# Altium schematic sheet PoE.schdoc
size 518 x 329 mm
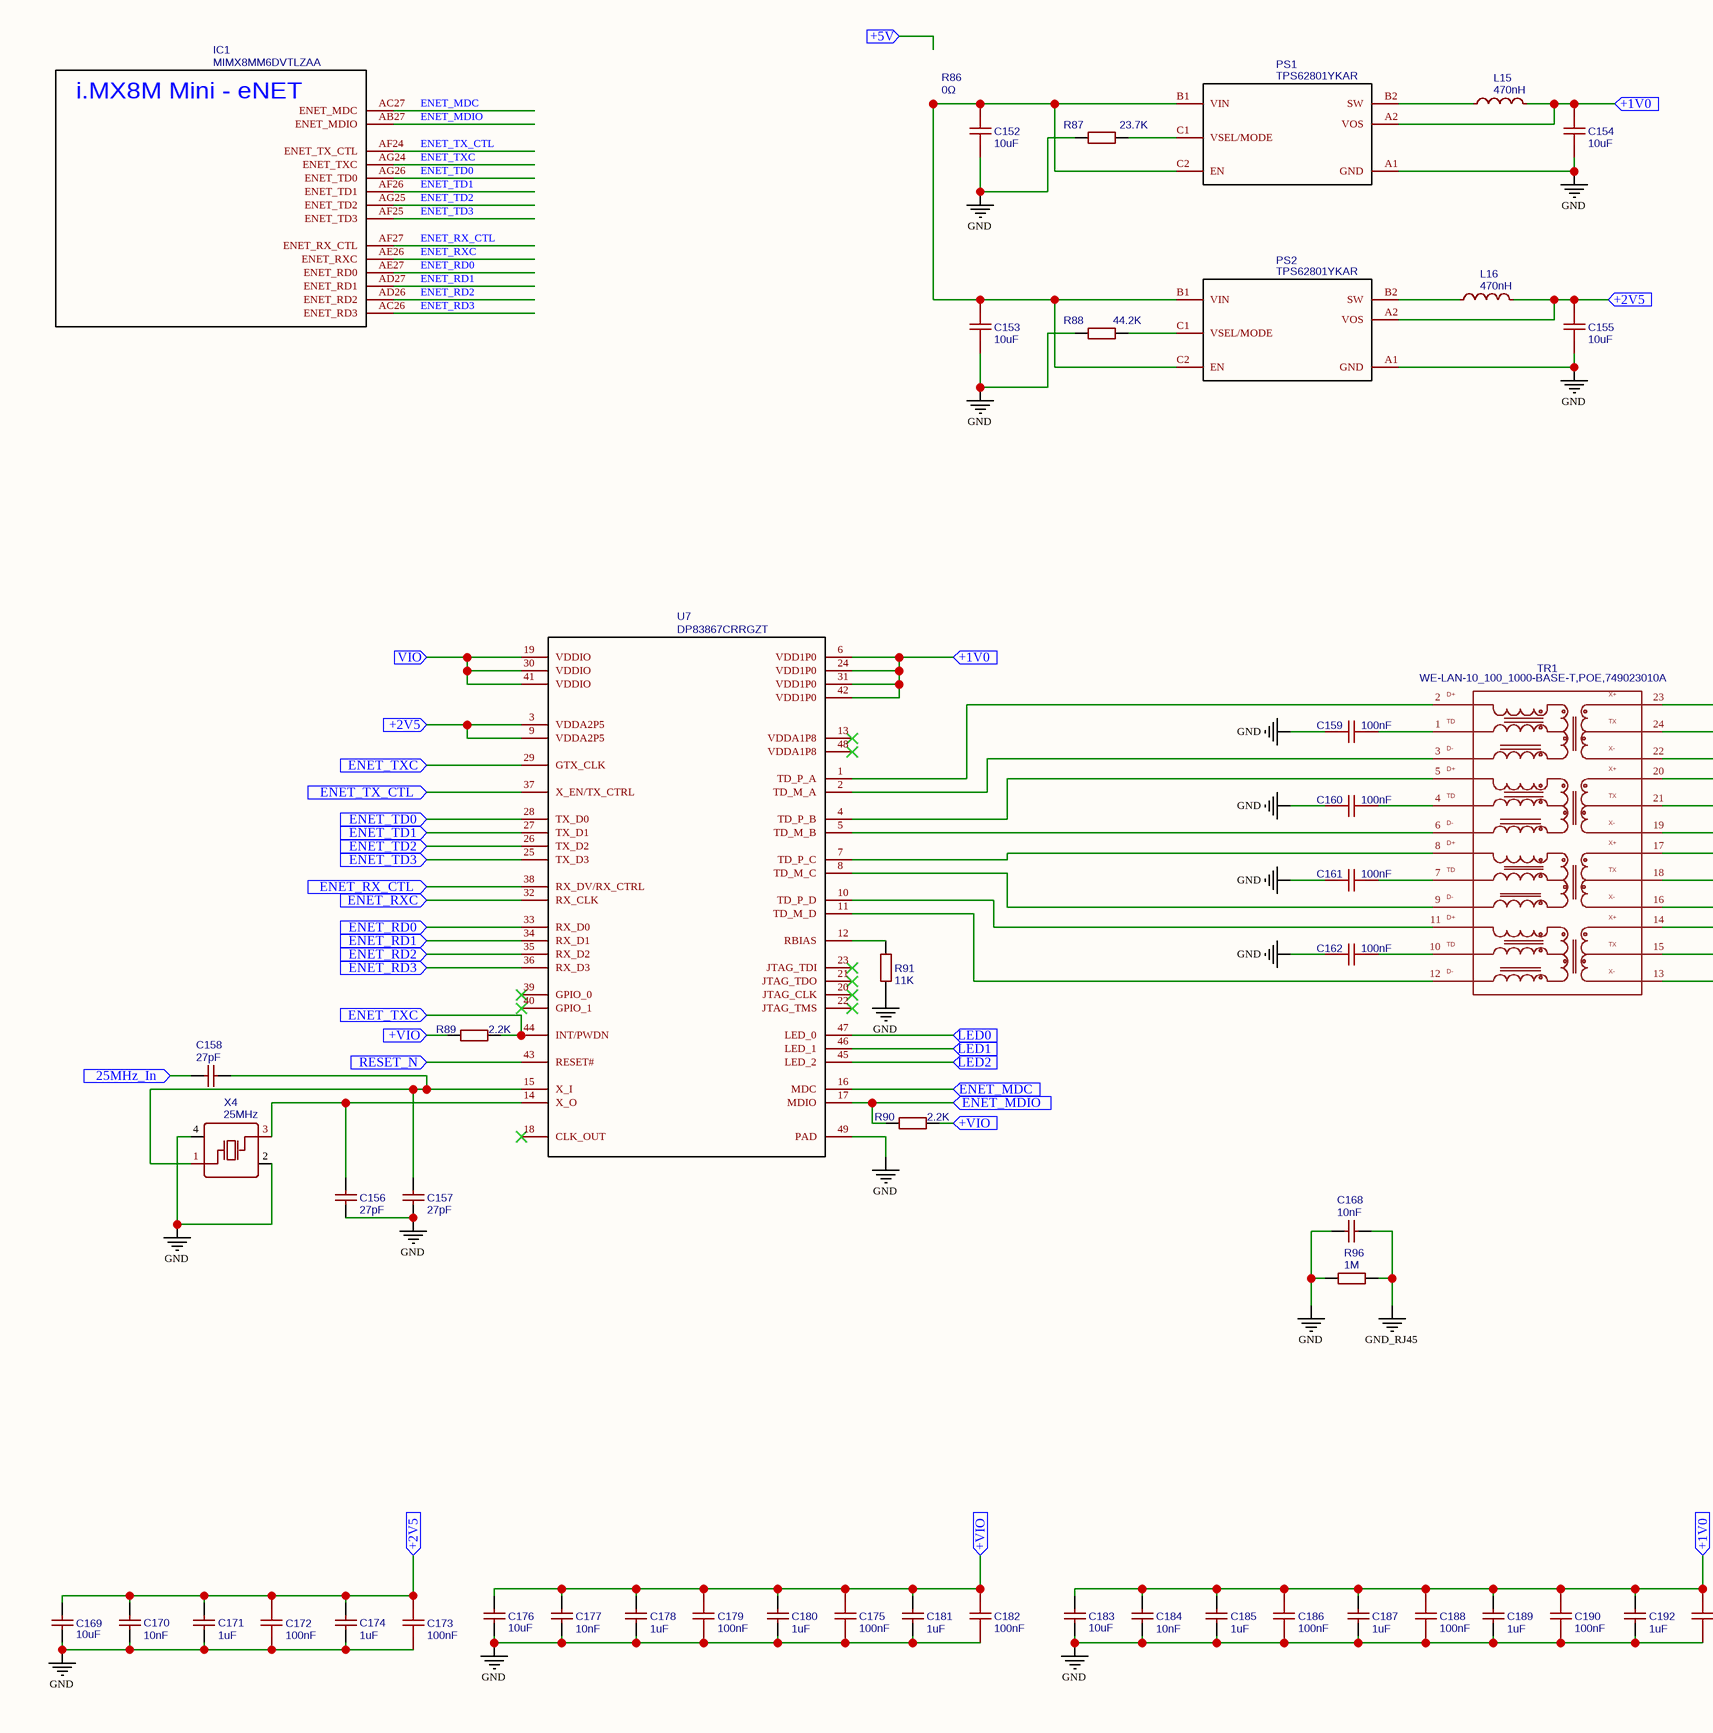
[diagram p0: PoE.schdoc, left]
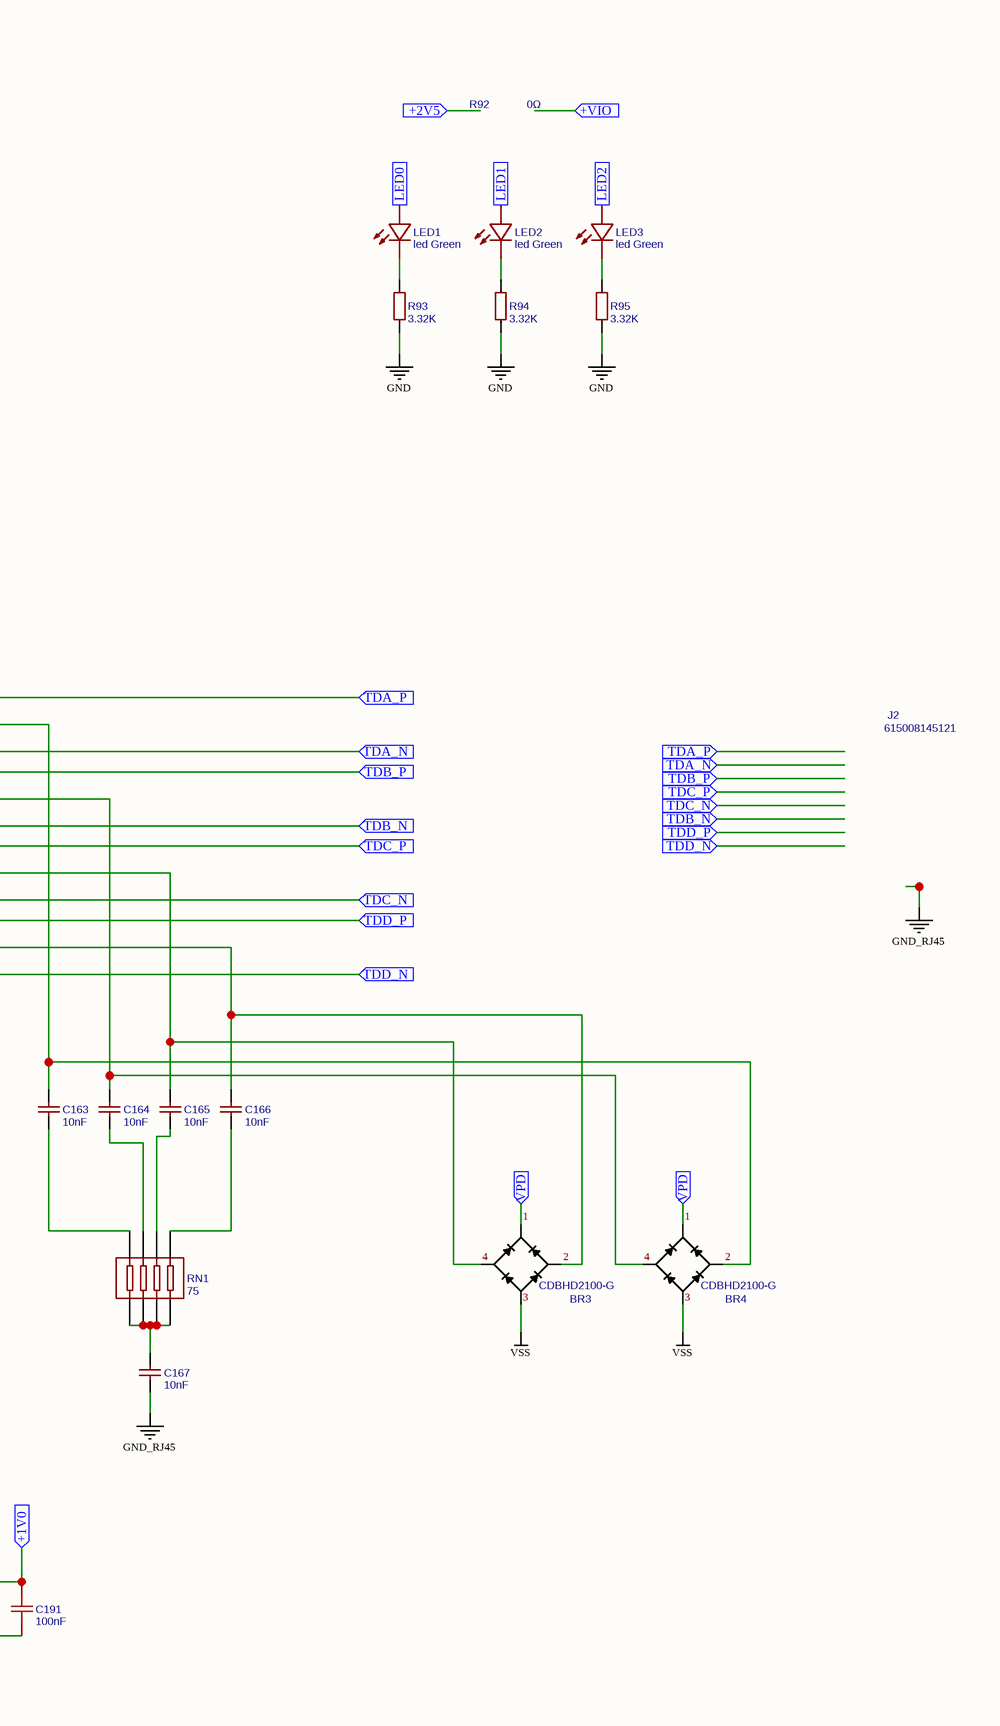
[diagram p1: PoE.schdoc, right]

## Parts
BR3  CDBHD2100-G  [SOP250P700X290-4N]
BR4  CDBHD2100-G  [SOP250P700X290-4N]
C152  10uF  [C1206]
C153  10uF  [C1206]
C154  10uF  [C1206]
C155  10uF  [C1206]
C156  27pF  [C0402]
C157  27pF  [C0402]
C158  27pF  [C0402]
C159  100nF  [C0603]
C160  100nF  [C0603]
C161  100nF  [C0603]
C162  100nF  [C0603]
C163  10nF  [C0805]
C164  10nF  [C0805]
C165  10nF  [C0805]
C166  10nF  [C0805]
C167  10nF  [C1206]
C168  10nF  [C1206]
C169  10uF  [C0402]
C170  10nF  [C0402]
C171  1uF  [C0603]
C172  100nF  [C0603]
C173  100nF  [C0603]
C174  1uF  [C0603]
C175  100nF  [C0603]
C176  10uF  [C0402]
C177  10nF  [C0402]
C178  1uF  [C0603]
C179  100nF  [C0603]
C180  1uF  [C0603]
C181  1uF  [C0603]
C182  100nF  [C0603]
C183  10uF  [C0402]
C184  10nF  [C0402]
C185  1uF  [C0603]
C186  100nF  [C0603]
C187  1uF  [C0603]
C188  100nF  [C0603]
C189  1uF  [C0603]
C190  100nF  [C0603]
C191  100nF  [C0603]
C192  1uF  [C0603]
IC1  MIMX8MM6DVTLZAA  [BGA486C50P27X27_1400X1400X125]
J2  615008145121  [615008145121]
L15  470nH  [L0603]
L16  470nH  [L0603]
LED1  led Green  [LED1206-RD]
LED2  led Green  [LED1206-RD]
LED3  led Green  [LED1206-RD]
PS1  TPS62801YKAR  [BGA6C35P2X3_70X105X40]
PS2  TPS62801YKAR  [BGA6C35P2X3_70X105X40]
R86  0Ω  [1206]
R87  23.7K  [R0402]
R88  44.2K  [R0402]
R89  2.2K  [R0402]
R90  2.2K  [R0402]
R91  11K  [R0402]
R92  0Ω  [1206]
R93  3.32K  [R0402]
R94  3.32K  [R0402]
R95  3.32K  [R0402]
R96  1M  [R0402]
RN1  75  [RES-ARRAY-SMD_0402-8P-L2.0-W1.0-BL]
TR1  WE-LAN-10_100_1000-BASE-T,POE,749023010A  [749023010A]
U7  DP83867CRRGZT  [QFN50P700X700X100-49N]
X4  25MHz  [OSC-SMD_4P-L3.2-W2.5-BL]

## Ports
25MHz_In (in), +1V0 (in), +2V5 (in), +5V (in), +VIO (in), ENET_MDC (in), ENET_MDIO (in), ENET_RD0 (in), ENET_RD1 (in), ENET_RD2 (in), ENET_RD3 (in), ENET_RX_CTL (in), ENET_RXC (in), ENET_TD0 (in), ENET_TD1 (in), ENET_TD2 (in), ENET_TD3 (in), ENET_TX_CTL (in), ENET_TXC (in), LED0 (in), LED1 (in), LED2 (in), RESET_N (in), TDA_N (in), TDA_P (in), TDB_N (in), TDB_P (in), TDC_N (in), TDC_P (in), TDD_N (in), TDD_P (in), VIO (in), VPD (in)

## Nets
GND: C152.1 C153.1 C154.1 C155.1 C156.1 C157.1 C159.1 C160.1 C161.1 C162.1 C168.2 C169.1 C170.1 C171.1 C172.1 C173.1 C174.1 C175.1 C176.1 C177.1 C178.1 C179.1 C180.1 C181.1 C182.1 C183.1 C184.1 C185.1 C186.1 C187.1 C188.1 C189.1 C190.1 C191.1 C192.1 PS1.A1(GND) PS2.A1(GND) R87.1 R88.1 R91.1 R93.1 R94.1 R95.1 R96.1 U7.49(PAD) X4.2(GND) X4.4(GND)
GND_RJ45: C167.1 C168.1 R96.2
VSS: BR3.3 BR4.3
25MHz_In: C158.2 ; port 25MHz_In
+1V0: C154.2 C183.2 C184.2 C185.2 C186.2 C187.2 C188.2 C189.2 C190.2 C191.2 C192.2 L15.2 PS1.A2(VOS) U7.6(VDD1P0) U7.24(VDD1P0) U7.31(VDD1P0) U7.42(VDD1P0) ; port +1V0
+2V5: C155.2 C169.2 C170.2 C171.2 C172.2 C173.2 C174.2 L16.2 PS2.A2(VOS) U7.3(VDDA2P5) U7.9(VDDA2P5) ; port +2V5
+VIO: C175.2 C176.2 C177.2 C178.2 C179.2 C180.2 C181.2 C182.2 R89.1 R90.2 ; port +VIO
ENET_MDC: IC1.AC27(ENET_MDC)
ENET_MDC: U7.16(MDC) ; port ENET_MDC  [a separate net that carries the same name]
ENET_MDIO: IC1.AB27(ENET_MDIO)
ENET_MDIO: R90.1 U7.17(MDIO) ; port ENET_MDIO  [a separate net that carries the same name]
ENET_RD0: IC1.AE27(ENET_RD0)
ENET_RD0: U7.33(RX_D0) ; port ENET_RD0  [a separate net that carries the same name]
ENET_RD1: IC1.AD27(ENET_RD1)
ENET_RD1: U7.34(RX_D1) ; port ENET_RD1  [a separate net that carries the same name]
ENET_RD2: IC1.AD26(ENET_RD2)
ENET_RD2: U7.35(RX_D2) ; port ENET_RD2  [a separate net that carries the same name]
ENET_RD3: IC1.AC26(ENET_RD3)
ENET_RD3: U7.36(RX_D3) ; port ENET_RD3  [a separate net that carries the same name]
ENET_RX_CTL: IC1.AF27(ENET_RX_CTL)
ENET_RX_CTL: U7.38(RX_DV/RX_CTRL) ; port ENET_RX_CTL  [a separate net that carries the same name]
ENET_RXC: IC1.AE26(ENET_RXC)
ENET_RXC: U7.32(RX_CLK) ; port ENET_RXC  [a separate net that carries the same name]
ENET_TD0: IC1.AG26(ENET_TD0)
ENET_TD0: U7.28(TX_D0) ; port ENET_TD0  [a separate net that carries the same name]
ENET_TD1: IC1.AF26(ENET_TD1)
ENET_TD1: U7.27(TX_D1) ; port ENET_TD1  [a separate net that carries the same name]
ENET_TD2: IC1.AG25(ENET_TD2)
ENET_TD2: U7.26(TX_D2) ; port ENET_TD2  [a separate net that carries the same name]
ENET_TD3: IC1.AF25(ENET_TD3)
ENET_TD3: U7.25(TX_D3) ; port ENET_TD3  [a separate net that carries the same name]
ENET_TX_CTL: IC1.AF24(ENET_TX_CTL)
ENET_TX_CTL: U7.37(X_EN/TX_CTRL) ; port ENET_TX_CTL  [a separate net that carries the same name]
ENET_TXC: IC1.AG24(ENET_TXC)
ENET_TXC: R89.2 U7.29(GTX_CLK) U7.44(INT/PWDN) ; port ENET_TXC  [a separate net that carries the same name]
LED0: LED1.2(+) U7.47(LED_0) ; port LED0
LED1: LED2.2(+) U7.46(LED_1) ; port LED1
LED2: LED3.2(+) U7.45(LED_2) ; port LED2
RESET_N: U7.43(RESET#) ; port RESET_N
TDA_N: TR1.22 ; port TDA_N
TDA_P: TR1.23 ; port TDA_P
TDB_N: TR1.19 ; port TDB_N
TDB_P: TR1.20 ; port TDB_P
TDC_N: TR1.16 ; port TDC_N
TDC_P: TR1.17 ; port TDC_P
TDD_N: TR1.13 ; port TDD_N
TDD_P: TR1.14 ; port TDD_P
VIO: U7.19(VDDIO) U7.30(VDDIO) U7.41(VDDIO) ; port VIO
VPD: BR3.1 BR4.1 ; port VPD
NetBR3_2: BR3.2 C166.2 TR1.15
NetBR3_4: BR3.4 C165.2 TR1.18
NetBR4_2: BR4.2 C163.2 TR1.24
NetBR4_4: BR4.4 C164.2 TR1.21
NetC152_2: C152.2 C153.2 PS1.B1(VIN) PS1.C2(EN) PS2.B1(VIN) PS2.C2(EN)
NetC156_2: C156.2 U7.14(X_O) X4.3(OSC2)
NetC157_2: C157.2 C158.1 U7.15(X_I) X4.1(OSC1)
NetC159_2: C159.2 TR1.1
NetC160_2: C160.2 TR1.4
NetC161_2: C161.2 TR1.7
NetC162_2: C162.2 TR1.10
NetC163_1: C163.1 RN1.8
NetC164_1: C164.1 RN1.7
NetC165_1: C165.1 RN1.6
NetC166_1: C166.1 RN1.5
NetC167_2: C167.2 RN1.1 RN1.2 RN1.3 RN1.4
NetL15_1: L15.1 PS1.B2(SW)
NetL16_1: L16.1 PS2.B2(SW)
NetLED1_1: LED1.1(-) R93.2
NetLED2_1: LED2.1(-) R94.2
NetLED3_1: LED3.1(-) R95.2
NetPS1_C1: PS1.C1(VSEL/MODE) R87.2
NetPS2_C1: PS2.C1(VSEL/MODE) R88.2
NetR91_2: R91.2 U7.12(RBIAS)
NetTR1_2: TR1.2 U7.1(TD_P_A)
NetTR1_3: TR1.3 U7.2(TD_M_A)
NetTR1_5: TR1.5 U7.4(TD_P_B)
NetTR1_6: TR1.6 U7.5(TD_M_B)
NetTR1_8: TR1.8 U7.7(TD_P_C)
NetTR1_9: TR1.9 U7.8(TD_M_C)
NetTR1_11: TR1.11 U7.10(TD_P_D)
NetTR1_12: TR1.12 U7.11(TD_M_D)

Not connected (* = marked no-connect by the designer): U7 13(VDDA1P8)* 18(CLK_OUT)* 20(JTAG_CLK)* 21(JTAG_TDO)* 22(JTAG_TMS)* 23(JTAG_TDI)* 39(GPIO_0)* 40(GPIO_1)* 48(VDDA1P8)*

## Notes on the sheet
- (in symbol MIMX8MM6DVTLZAA) i.MX8M Mini - eNET
- (in symbol WE-LAN-10_100_1000-BASE-T,POE,749023010A) D+; X+; TD; TX; D-; X-

## Library data of the parts
BR3 BR4 = CDBHD2100-G: Contributor: Ke'Ondrae_Mell; BOM_Supplier: Mouser; spicePre: B; spiceSymbolName: CDBHD2100-G
C152-C155 = 10uF: BOM_Manufacturer: FH; BOM_Manufacturer Part: 1206B106K250NT; nameAlias: Capacitance; SMT Type: Extend; BOM_Supplier: LCSC; BOM_Supplier Part: C90538; BOM_JLCPCB SMD: Yes; spicePre: C; spiceSymbolName: 1206B106K250NT
C156-C158 = 27pF: BOM_Manufacturer: FH; BOM_Manufacturer Part: 0402CG270J500NTN; nameAlias: Capacitance; SMT Type: Basic; BOM_Supplier: LCSC; BOM_Supplier Part: C1557; BOM_JLCPCB SMD: Yes; spicePre: C; spiceSymbolName: 0402CG270J500NTN
C159-C162 = 100nF: BOM_Manufacturer: SAMSUNG; BOM_Manufacturer Part: CL10B104KC8NNNC; nameAlias: Capacitance; SMT Type: Extend; BOM_Supplier: LCSC; BOM_Supplier Part: C15725; BOM_JLCPCB SMD: Yes; spicePre: C; spiceSymbolName: CL10B104KC8NNNC
C163-C166 = 10nF: BOM_Manufacturer Part: CL21B103KCANNNC; BOM_Manufacturer: SAMSUNG; nameAlias: Capacitance; SMT Type: Extend; BOM_Supplier: LCSC; BOM_Supplier Part: C18741; BOM_JLCPCB SMD: Yes; spicePre: C; spiceSymbolName: CL21B103KCANNNC
C167 C168 = 10nF: BOM_Manufacturer: FH; BOM_Manufacturer Part: 1206B103K202NT; nameAlias: Capacitance; SMT Type: Extend; BOM_Supplier: LCSC; BOM_Supplier Part: C53737; BOM_JLCPCB SMD: Yes; spicePre: C; spiceSymbolName: 1206B103K202NT
C169 C176 C183 = 10uF: BOM_Manufacturer Part: CL05A106MQ5NUNC; BOM_Manufacturer: SAMSUNG; nameAlias: Capacitance; SMT Type: Basic; BOM_Supplier: LCSC; BOM_Supplier Part: C15525; BOM_JLCPCB SMD: Yes; spicePre: C; spiceSymbolName: CL05A106MQ5NUNC
C170 C177 C184 = 10nF: BOM_Manufacturer Part: CL05B103KB5NNNC; BOM_Manufacturer: SAMSUNG; nameAlias: Capacitance; SMT Type: Basic; BOM_Supplier: LCSC; BOM_Supplier Part: C15195; BOM_JLCPCB SMD: Yes; spicePre: C; spiceSymbolName: CL05B103KB5NNNC
C171 C174 C178 C180 C181 C185 C187 C189 C192 = 1uF: BOM_Manufacturer Part: CL10A105KA8NNNC; BOM_Manufacturer: SAMSUNG; nameAlias: Capacitance; SMT Type: Extend; BOM_Supplier: LCSC; BOM_Supplier Part: C5673; BOM_JLCPCB SMD: Yes; spicePre: C; spiceSymbolName: CL10A105KA8NNNC
C172 C173 C175 C179 C182 C186 C188 C190 C191 = 100nF: BOM_Manufacturer: YAGEO; BOM_Manufacturer Part: CC0603KRX7R9BB104; nameAlias: Capacitance; SMT Type: Basic; BOM_Supplier: LCSC; BOM_Supplier Part: C14663; BOM_JLCPCB SMD: Yes; spicePre: C; spiceSymbolName: CC0603KRX7R9BB104
IC1 = MIMX8MM6DVTLZAA: subpart_no: 2; Contributor: Ke'Ondrae_Mell; spicePre: I; spiceSymbolName: MIMX8MM6DVTLZAA
J2 = 615008145121: Contributor: Ke'Ondrae_Mell; spicePre: J; spiceSymbolName: 615008145121
L15 L16 = 470nH: BOM_Manufacturer: Sunlord; BOM_Manufacturer Part: SDCL1608CR47JTDF; nameAlias: Inductance; SMT Type: Extend; BOM_Supplier: LCSC; BOM_Supplier Part: C21307; BOM_JLCPCB SMD: Yes; spicePre: L; spiceSymbolName: SDCL1608CR47JTDF
LED1-LED3 = led Green: BOM_Manufacturer: KENTO; SMT Type: Extend; BOM_Supplier: LCSC; BOM_Manufacturer Part: led Green; image: //image.lceda.cn/szlcsc/C14641.jpg; BOM_Supplier Part: C14641; BOM_JLCPCB SMD: Yes; spicePre: L; spiceSymbolName: led Green
PS1 PS2 = TPS62801YKAR: Contributor: Ke'Ondrae_Mell; spicePre: P; spiceSymbolName: TPS62801YKAR
R86 R92 = 0Ω: BOM_Manufacturer Part: 0R(000) ±1%; Value: 0Ω; BOM_Supplier Part: undefined; BOM_Supplier: LCSC; spicePre: R; spiceSymbolName: 0Ω
R87 = 23.7K: BOM_Manufacturer: UniOhm; BOM_Manufacturer Part: 0402WGF2372TCE; nameAlias: Resistance (Ohms); SMT Type: Extend; BOM_Supplier: LCSC; BOM_Supplier Part: C82134; BOM_JLCPCB SMD: Yes; spicePre: R; spiceSymbolName: 0402WGF2372TCE
R88 = 44.2K: BOM_Manufacturer: UniOhm; BOM_Manufacturer Part: 0402WGF4422TCE; nameAlias: Resistance (Ohms); SMT Type: Extend; BOM_Supplier: LCSC; BOM_Supplier Part: C25895; BOM_JLCPCB SMD: Yes; spicePre: R; spiceSymbolName: 0402WGF4422TCE
R89 R90 = 2.2K: BOM_Manufacturer: UniOhm; BOM_Manufacturer Part: 0402WGF2201TCE; nameAlias: Resistance (Ohms); SMT Type: Basic; BOM_Supplier: LCSC; BOM_Supplier Part: C25879; BOM_JLCPCB SMD: Yes; spicePre: R; spiceSymbolName: 0402WGF2201TCE
R91 = 11K: BOM_Manufacturer: UniOhm; BOM_Manufacturer Part: 0402WGF1102TCE; nameAlias: Resistance (Ohms); SMT Type: Extend; BOM_Supplier: LCSC; BOM_Supplier Part: C25749; BOM_JLCPCB SMD: Yes; spicePre: R; spiceSymbolName: 0402WGF1102TCE
R93-R95 = 3.32K: BOM_Manufacturer: UniOhm; BOM_Manufacturer Part: 0402WGF3321TCE; nameAlias: Resistance (Ohms); SMT Type: Extend; BOM_Supplier: LCSC; BOM_Supplier Part: C60075; BOM_JLCPCB SMD: Yes; spicePre: R; spiceSymbolName: 0402WGF3321TCE
R96 = 1M: BOM_Manufacturer: UniOhm; BOM_Manufacturer Part: 0402WGF1004TCE; nameAlias: Resistance (Ohms); SMT Type: Basic; BOM_Supplier: LCSC; BOM_Supplier Part: C26083; BOM_JLCPCB SMD: Yes; spicePre: R; spiceSymbolName: 0402WGF1004TCE
RN1 = 75: BOM_Manufacturer: UniOhm; BOM_Manufacturer Part: 4D02WGJ0750TCE; nameAlias: Resistance (Ohms); SMT Type: Extend; BOM_Supplier: LCSC; BOM_Supplier Part: C39128; BOM_JLCPCB SMD: Yes; spicePre: R; spiceSymbolName: 4D02WGJ0750TCE
TR1 = WE-LAN-10_100_1000-BASE-T,POE,749023010A: description: LAN-Transformer WE-LAN 10101000 Base Tx; timeStamp: 1469625502; spicePre: T; spiceSymbolName: WE-LAN-10_100_1000-BASE-T,POE,749023010A
U7 = DP83867CRRGZT: Contributor: Ke'Ondrae_Mell; spicePre: U; spiceSymbolName: DP83867CRRGZT
X4 = 25MHz: BOM_Manufacturer: YXC; BOM_Manufacturer Part: X322525MSB4SI; nameAlias: Frequency; SMT Type: Extend; BOM_Supplier: LCSC; BOM_Supplier Part: C13740; BOM_JLCPCB SMD: Yes; spicePre: X; spiceSymbolName: X322525MSB4SI